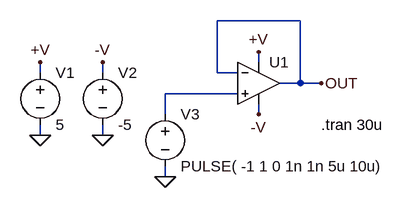
[diagram p0: schematic CallUniversal.asc]
CallUniversal.asc, the LTspice schematic file:
Version 4
SHEET 1 880 680
WIRE -144 240 -144 224
WIRE -144 336 -144 320
WIRE -48 240 -48 224
WIRE -48 336 -48 320
WIRE 48 304 48 272
WIRE 48 400 48 384
WIRE 128 240 128 160
WIRE 160 240 128 240
WIRE 160 272 48 272
WIRE 192 224 192 208
WIRE 192 304 192 288
WIRE 256 160 128 160
WIRE 256 256 224 256
WIRE 256 256 256 160
WIRE 288 256 256 256
FLAG -144 224 +V
FLAG 192 208 +V
FLAG 192 304 -V
FLAG -48 224 -V
FLAG -48 336 0
FLAG -144 336 0
FLAG 48 400 0
FLAG 288 256 OUT
SYMBOL opamps\\universalopamp2 192 256 R0
SYMATTR InstName U1
SYMATTR SpiceModel level.3a
SYMATTR SpiceLine ilimit=25m rail=0 Vos=0 phimargin=30
SYMBOL voltage -144 224 R0
SYMATTR InstName V1
SYMATTR Value 5
SYMBOL voltage -48 224 R0
SYMATTR InstName V2
SYMATTR Value -5
SYMBOL voltage 48 288 R0
SYMATTR InstName V3
SYMATTR Value PULSE( -1 1 0 1n 1n 5u 10u)
TEXT 288 320 Left 0 !.tran 30u

The netlist it stands for:
* CallUniversal.asc
XU1 N001 OUT +V -V OUT level.3a Avol=1Meg GBW=10Meg Slew=10Meg ilimit=25m rail=0 Vos=0 phimargin=30 en=0 enk=0 in=0 ink=0 Rin=500Meg  ; pins IN+ IN- V+ V- OUT
V1 +V 0 5
V2 -V 0 -5
V3 N001 0 PULSE( -1 1 0 1n 1n 5u 10u)
.tran 30u
.lib UniversalOpamps2.sub
.backanno
.end